# EAGLE design bGeigieNanoKit V1.1r4a (EAGLE 7.7.0)
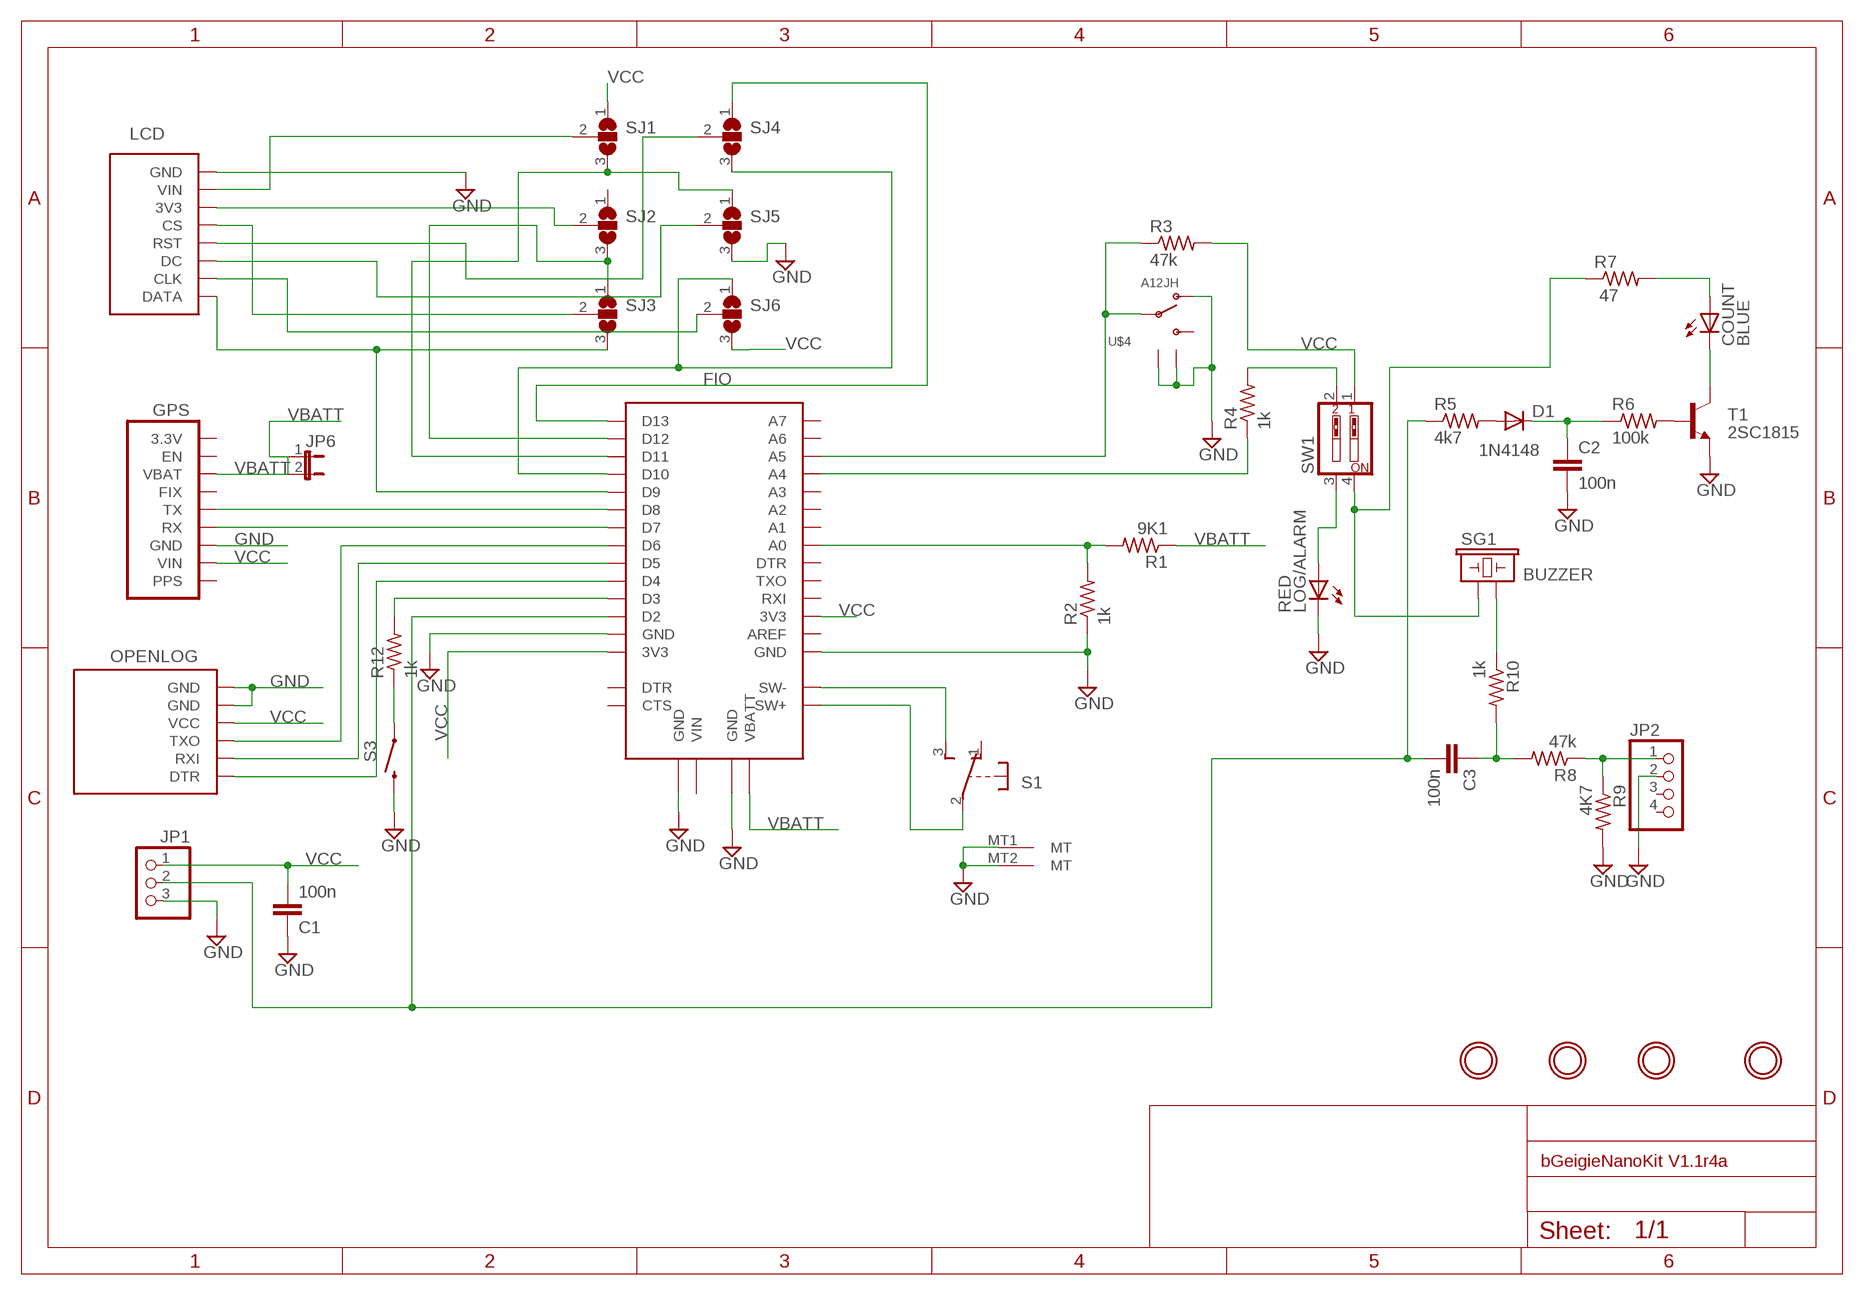
[diagram p0: schematic, sheet 1]

## Parts
C1  100n  C-EU025-024X044  [C025-024X044]
C2  100n  C-EU025-024X044  [C025-024X044]
C3  100n  C-EU025-024X044  [C025-024X044]
COUNT  BLUE  LED3MM  [LED3MM]
D1  1N4148  1N4148DO35-7  [DO35-7]
FIO  FIO_SOCKETBOT  [FIO_V23_SOCKET_BOT]
GPS  ULTIMATE_GPSTOP  [ULTIMATE_GPS_V3_TOP]
JP1  PINHD-1X3/90  [1X03/90]
JP2  HEADER-1X4ROUND  [1X04_ROUND]
JP6  JUMPER-2SMD-NC  [SJ_2S]
LCD  SSD1306_128X64_V2_LCD1.3IN_LEVER  [SSD1306_128X64_1.3IN_LCD_LEVER]
LOG/ALARM  RED  LED3MM  [LED3MM]
OPENLOG  OPENLOG  [OPENLOG]
R1  9K1  R-US_0207/10  [0207/10]
R2  1k  R-US_0207/10  [0207/10]
R3  47k  R-US_0207/10  [0207/10]
R4  1k  R-US_0207/10  [0207/10]
R5  4k7  R-US_0207/10  [0207/10]
R6  100k  R-US_0207/10  [0207/10]
R7  47  R-US_0207/10  [0207/10]
R8  47k  R-US_0207/10  [0207/10]
R9  4K7  R-US_0207/10  [0207/10]
R10  1k  R-US_0207/10  [0207/10]
R12  1k  R-US_0207/10  [0207/10]
S1  S1  EG1206  [EG1206]
S3  SWITCH-MOMENTARY-2PTH  [TACTILE-PTH]
SG1  BUZZER  BUZZERPTH  [BUZZER-12MM]
SJ1  SJ2W  [SJ_2]
SJ2  SJ2W  [SJ_2]
SJ3  SJ2W  [SJ_2]
SJ4  SJ2W  [SJ_2]
SJ5  SJ2W  [SJ_2]
SJ6  SJ2W  [SJ_2]
SW1  SW_DIP-2  [EDG-02]
T1  2SC1815  [TO92-ECB]
U$4  A12JH  [A12AH]
U$6  MOUNTINGHOLE3.0THIN  [MOUNTINGHOLE_3.0_PLATEDTHIN]
U$7  MOUNTINGHOLE3.0THIN  [MOUNTINGHOLE_3.0_PLATEDTHIN]
U$8  MOUNTINGHOLE3.0THIN  [MOUNTINGHOLE_3.0_PLATEDTHIN]
U$9  MOUNTINGHOLE3.0THIN  [MOUNTINGHOLE_3.0_PLATEDTHIN]

## Nets
GND [PWP]: C1.1 C2.2 FIO.JP1$2(GND) FIO.JP2$1(GND) FIO.JP5$1(GND) FIO.JP6$1(GND) GPS.JP1$3(GND) GPS.U$8$P$1(GND) GPS.U$9$P$1(GND) JP1.3 JP2.2 LCD.JP1$8(GND) LCD.U$23$P$1(GND) LCD.U$26$P$1(GND) LOG/ALARM.K(C) OPENLOG.JP1$5(GND) OPENLOG.JP1$6(GND) R2.1 R9.2 S1.MT1(MT) S1.MT2(MT) S3.3 SJ5.3 T1.E U$4.P$1 U$4.P$4(GND) U$4.P$5(GND)
N$1: FIO.JP1$10(D9) LCD.JP1$1(DATA) SJ3.3
N$2: FIO.JP1$11(D10) SJ4.3 SJ6.1
N$3: FIO.JP1$12(D11) SJ1.3 SJ5.1
N$4: FIO.JP1$13(D12) SJ2.3 SJ3.1
N$5: FIO.JP1$14(D13) SJ4.1
N$6: FIO.JP1$9(D8) GPS.JP1$5(TX)
N$7: FIO.JP1$8(D7) GPS.JP1$4(RX)
N$8: FIO.JP1$7(D6) OPENLOG.JP1$3(TXO)
N$9: FIO.JP1$6(D5) OPENLOG.JP1$2(RXI)
N$10: FIO.JP1$5(D4) OPENLOG.JP1$1(DTR)
N$11: FIO.JP5$7(A0) R1.2 R2.2
N$12 [HIGH_PWR]: FIO.JP7$2(SW+) S1.2(1:P)
N$13 [HIGH_PWR]: FIO.JP7$1(SW-) S1.3(1:S)
N$14: FIO.JP5$12(A5) R3.1 U$4.P$2
N$16: LOG/ALARM.A SW1.3
N$17: R4.2 SW1.2
N$18: C3.2 FIO.JP1$3(D2) JP1.2 R5.1
N$19: COUNT.A R7.2
N$20: R12.1 S3.1
N$22: COUNT.K(C) T1.C
N$23: R10.1 SG1.-
N$24: C3.1 R8.2 R10.2
N$25: JP2.1 R8.1 R9.1
N$26: D1.A R5.2
N$27: C2.1 D1.C R6.1
N$28: R6.2 T1.B
N$30: FIO.JP1$4(D3) R12.2
N$31: LCD.JP1$7(VIN) SJ1.2
N$32: R7.1 SG1.+ SW1.4
N$33: FIO.JP5$11(A4) R4.1
N$34: LCD.JP1$6(3V3) SJ2.2
N$35: LCD.JP1$5(CS) SJ3.2
N$36: LCD.JP1$4(RST) SJ4.2
N$37: LCD.JP1$3(DC) SJ5.2
N$38: LCD.JP1$2(CLK) SJ6.2
VBATT: FIO.JP2$2(VBATT) GPS.JP1$7(VBAT) JP6.1 JP6.2 R1.1
VCC [PWP]: C1.2 FIO.JP1$1(3V3) FIO.JP5$3(3V3) GPS.JP1$2(VIN) JP1.1 OPENLOG.JP1$4(VCC) R3.2 SJ1.1 SJ6.3 SW1.1
Unconnected: FIO.JP5$2(AREF) FIO.JP5$4(RXI) FIO.JP5$5(TXO) FIO.JP5$6(DTR) FIO.JP5$8(A1) FIO.JP5$9(A2) FIO.JP5$10(A3) FIO.JP5$13(A6) FIO.JP5$14(A7) FIO.JP6$2(VIN) FIO.JP8$1(CTS) FIO.JP9$1(DTR) GPS.JP1$1(PPS) GPS.JP1$6(FIX) GPS.JP1$8(EN) GPS.JP1$9(3.3V) JP2.3 JP2.4 S1.1(1:O) SJ2.1 U$4.P$3

## Library data of the parts
C1-C3 = rcl:C-EU: CAPACITOR, European symbol
COUNT LOG/ALARM = adafruit:LED: LED OSRAM: - CHIPLED LG R971, LG N971, LY N971, LG Q971, LY Q971, LO R971, LY R971 LH N974, LH R974 LS Q976, LO Q976, LY Q976 LO Q996 - Hyper CHIPLED LW Q18S LB Q993, LB Q99A, LB R99A - SideLED LS A670, LO A670, LY A670, LG A670, LP A670 LB A673, LV A673, LT A673, LW A673 LH A674 LY A675 LS A676, LA A676, LO A676, LY A676, LW A676 LS A679, LY A679, LG A679 - Hyper Micro SIDELED® LS Y876, LA Y876, LO Y876, LY Y876 LT Y87S - SmartLED LW L88C, LW L88S LB L89C, LB L89S, LG L890 LS L89K, LO L89K, LY L89K LS L896, LA L896, LO L896, LY L896 - TOPLED LS T670, LO T670, LY T670, LG T670, LP T670 LSG T670, LSP T670, LSY T670, LOP T670, LYG T670 LG T671, LOG T671, LSG T671 LB T673, LV T673, LT T673, LW T673 LH T674 LS T676, LA T676, LO T676, LY T676, LB T676, LH T676, LSB T676, LW T676 LB T67C, LV T67C, LT T67C, LS T67K, LO T67K, LY T67K, LW E67C LS E67B, LA E67B, LO E67B, LY E67B, LB E67C, LV E67C, LT E67C LW T67C LS T679, LY T679, LG T679 LS T770, LO T770, LY T770, LG T770, LP T770 LB T773, LV T773, LT T773, LW T773 LH T774 LS E675, LA E675, LY E675, LS T675 LS T776, LA T776, LO T776, LY T776, LB T776 LHGB T686 LT T68C, LB T68C - Hyper Mini TOPLED® LB M676 - Mini TOPLED Santana® LG M470 LS M47K, LO M47K, LY M47K Source: http://www.osram.convergy.de/
D1 = diode:1N4148: DIODE high speed (Philips); D1: 1N4148
FIO = open_hw_sockets:FIO_SOCKET
GPS = open_hw_sockets:ULTIMATE_GPS
JP1 = pinhead:PINHD-1X3: PIN HEADER
JP2 = microbuilder:HEADER-1X4: PIN HEADER
JP6 = SparkFun:JUMPER-2: Jumper Basic 0.1" spaced jumper. Use with breakaway headers.
LCD = open_hw_sockets:SSD1306_128X64_V2_LCD
OPENLOG = open_hw_sockets:OPENLOG
R1-R10 R12 = rcl:R-US_: RESISTOR, American symbol
S1 = open_hw_sockets:EG1206: E-Switch right-angle slide SPDT Part #EG1213 http://www.ladyada.net/library/eagle
S3 = SparkFun:SWITCH-MOMENTARY-2
SG1 = SparkFun-Electromechanical:BUZZER: Buzzer 12mm Spark Fun Electronics SKU : Comp-Buzzer
SJ1-SJ6 = jumper:SJ2W: SMD solder JUMPER
SW1 = special:SW_DIP-2: DIP SWITCH
T1 = transistor:2SC1815: NPN EPITAXIAL TRANSISTOR Source: TOSHIBA .. 2SC1815 1.pdf
U$4 = open_hw_sockets:A12JH
U$6-U$9 = microbuilder:MOUNTINGHOLE: Mounting Hole For #2 screws (0.086"/2.18mm width, 0.094"/2.4mm hole) use 2.5mm

## Net classes
0 default: width 0.406 mm, drill 0.254 mm, clearance 0.305 mm
1 PWP: width 0.813 mm, drill 0.254 mm, clearance 0.305 mm
2 HIGH_PWR: width 1.422 mm, drill 0.508 mm, clearance 0.406 mm

## Board
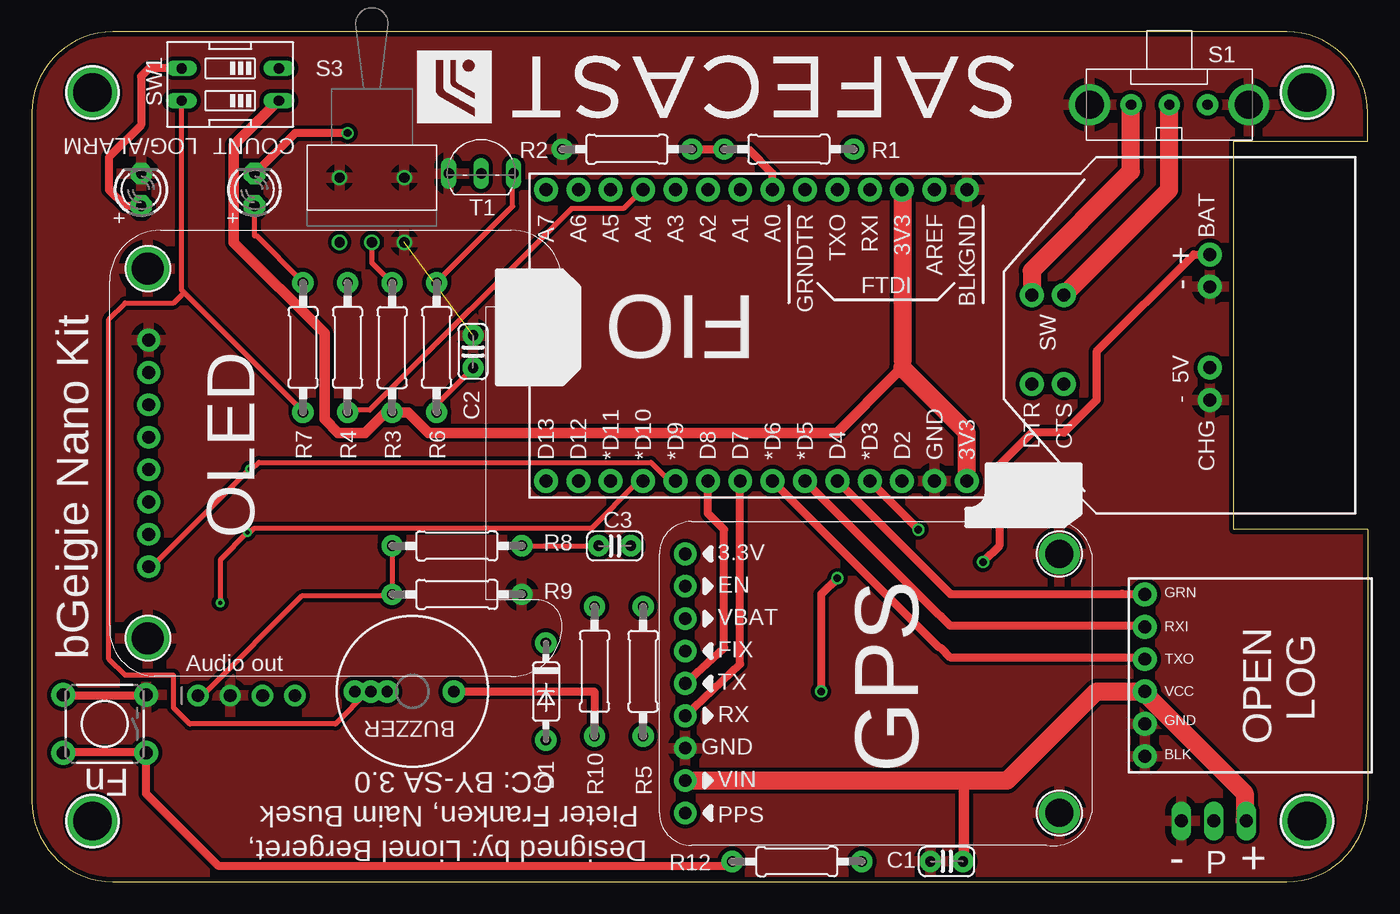
[diagram p1: board, top side]
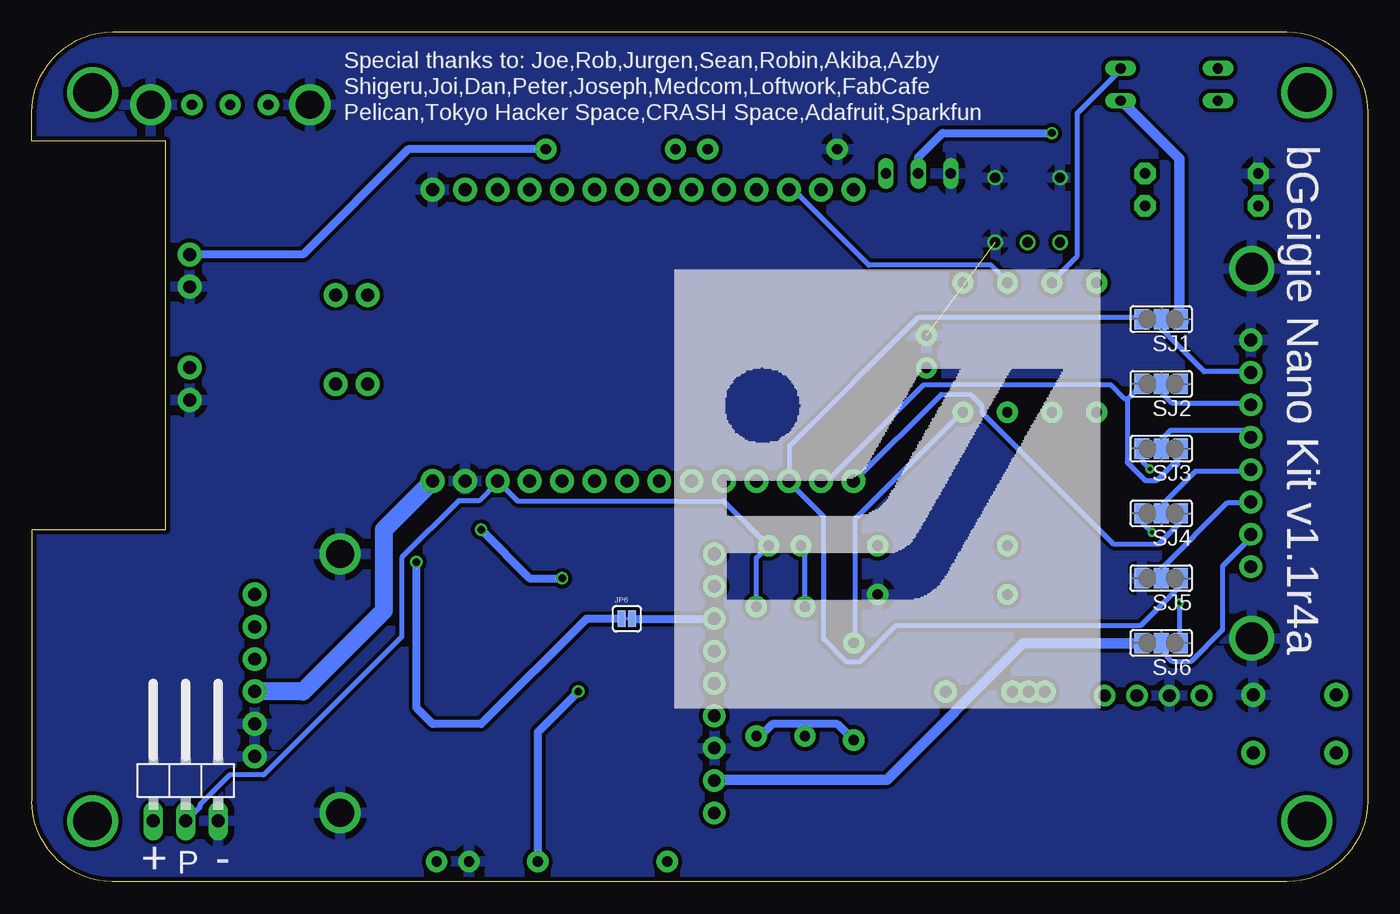
[diagram p2: board, bottom side, seen from below]

Size 104.77 x 66.67 mm. Coordinates in mm from the lower left corner, seen from the top.
Outline: 0,60.33 0,6.35 arc90 6.35,0 98.43,0 arc90 104.77,6.35 104.77,27.62 94.3,27.62 94.3,58.1 104.77,58.1 104.77,60.33 arc90 98.43,66.68 6.35,66.68 arc90 0,60.33
Copper layers (1*16): Top 0.0356mm / dielectric 1.5011mm / Bottom 0.0356mm
Design rules "LaenPCBOrder *": minimum track width 6mil, minimum drill 13mil, track to track 6mil, track to pad 6mil, pad to pad 6mil, via to via 6mil, smd to smd 6mil, copper to edge 15mil, drill to drill 6mil, minimum pad ring 7mil, minimum via ring 7mil, stop-mask expansion 4mil, vias tented up to drill 0mil, thermal gap 20mil

### Footprints (pad centres in the part's own frame; a part is rotated, then mirrored left to right if it is on the bottom)
C025-024X044 = drill 0.813 pad 1.676: 1 -1.27,0; 2 1.27,0
LED3MM = drill 0.813 pad 1.676 octagon: A -1.27,0; K 1.27,0
DO35-7 = drill 0.813 pad 1.676: A 3.81,0; C -3.81,0
FIO_V23_SOCKET_BOT = drill 1.016 pad 1.88: JP1$1 1.27,34.29; JP1$2 1.27,31.75; JP1$3 1.27,29.21; JP1$4 1.27,26.67; JP1$5 1.27,24.13; JP1$6 1.27,21.59; JP1$7 1.27,19.05; JP1$8 1.27,16.51; JP1$9 1.27,13.97; JP1$10 1.27,11.43; JP1$11 1.27,8.89; JP1$12 1.27,6.35; JP1$13 1.27,3.81; JP1$14 1.27,1.27; JP2$1 16.51,53.34; JP2$2 19.05,53.34; JP5$1 24.13,34.29; JP5$2 24.13,31.75; JP5$3 24.13,29.21; JP5$4 24.13,26.67; JP5$5 24.13,24.13; JP5$6 24.13,21.59; JP5$7 24.13,19.05; JP5$8 24.13,16.51; JP5$9 24.13,13.97; JP5$10 24.13,11.43; JP5$11 24.13,8.89; JP5$12 24.13,6.35; JP5$13 24.13,3.81; JP5$14 24.13,1.27; JP6$1 7.62,53.34; JP6$2 10.16,53.34; JP7$1 15.875,39.37; JP7$2 15.875,41.91; JP8$1 8.89,41.91; JP9$1 8.89,39.37
ULTIMATE_GPS_V3_TOP = drill 1 pad 1.778: JP1$1 22.86,2.032; JP1$2 20.32,2.032; JP1$3 17.78,2.032; JP1$4 15.24,2.032; JP1$5 12.7,2.032; JP1$6 10.16,2.032; JP1$7 7.62,2.032; JP1$8 5.08,2.032; JP1$9 2.54,2.032 | drill 2.2 pad 3: U$8$P$1 2.54,31.385; U$9$P$1 22.86,31.385
1X03/90 = drill 1.016 long: 1 -2.54,-3.81; 2 0,-3.81; 3 2.54,-3.81
1X04_ROUND = drill 1 pad 1.676: 1 -3.81,0; 2 -1.27,0; 3 1.27,0; 4 3.81,0
SJ_2S = smd 0.635 x 1.27: 1 -0.412,0; 2 0.412,0
SSD1306_128X64_1.3IN_LCD_LEVER = drill 1 pad 1.778: JP1$1 8.61,32.43; JP1$2 11.15,32.43; JP1$3 13.69,32.43; JP1$4 16.23,32.43; JP1$5 18.77,32.43; JP1$6 21.31,32.43; JP1$7 23.85,32.43; JP1$8 26.39,32.43 | drill 2.5 pad 3.2: U$23$P$1 32,32.5; U$26$P$1 3,32.5
OPENLOG = drill 1.016 pad 1.88: JP1$1 1.27,1.27; JP1$2 3.81,1.27; JP1$3 6.35,1.27; JP1$4 8.89,1.27; JP1$5 11.43,1.27; JP1$6 13.97,1.27
0207/10 = drill 0.813 pad 1.676: 1 -5.08,0; 2 5.08,0
EG1206 = drill 0.8 pad 1.676: 1 -3,0; 2 0,0; 3 3,0 | drill 2.2 pad 3: MT1 -6.25,0; MT2 6.25,0
TACTILE-PTH = drill 1.016 pad 1.88: 1 -3.251,2.261; 2 3.251,2.261; 3 -3.251,-2.261; 4 3.251,-2.261
BUZZER-12MM = drill 0.9 pad 1.778: + 3.25,0; +1 4.52,0; +2 3.25,0; +3 1.98,0; - -3.25,0
SJ_2 = smd 1.168 x 1.6: 1 -1.524,0; 2 0,0; 3 1.524,0
EDG-02 = drill 0.813 long: 1 -1.27,-3.81; 2 1.27,-3.81; 3 1.27,3.81; 4 -1.27,3.81
TO92-ECB = drill 0.813 long: B 2.54,0; C 0,0; E -2.54,0
A12AH = drill 0.8: P$1 -2.54,5.08; P$2 0,5.08; P$3 2.54,5.08; P$4 -2.54,0; P$5 2.54,0
MOUNTINGHOLE_3.0_PLATEDTHIN = drill 3 pad 3.6: P$1 0,0

### Placement (x,y rotation side)
C1  71.75,1.59 0 top
C2  34.61,41.59 90 top
C3  45.72,26.35 0 top
COUNT  17.46,54.29 90 top
D1  40.32,14.92 270 top
FIO  39.05,30.16 90 bottom
GPS  49.21,28.26 270 top
JP1  92.71,8.57 0 bottom
JP2  16.83,14.6 0 top
JP6  58.1,20.64 0 bottom
LCD  41.59,16.1 90 top
LOG/ALARM  8.57,54.29 90 top
OPENLOG  86.04,23.81 270 top
R1  59.37,57.47 180 top
R2  46.67,57.47 0 top
R3  28.26,41.91 270 top
R4  24.77,41.91 90 top
R5  47.94,16.51 270 top
R6  31.75,41.91 90 top
R7  21.27,41.91 90 top
R8  33.34,26.35 0 top
R9  33.34,22.54 0 top
R10  44.13,16.51 90 top
R12  60.01,1.59 0 top
S1  89.22,60.96 180 top
S3  5.71,12.38 180 top
SG1  29.85,14.92 180 top
SJ1  16.19,44.13 180 bottom
SJ2  16.19,39.05 180 bottom
SJ3  16.19,33.97 180 bottom
SJ4  16.19,28.89 180 bottom
SJ5  16.19,23.81 180 bottom
SJ6  16.19,18.73 180 bottom
SW1  15.56,62.55 90 top
T1  35.24,55.56 0 top
U$1  [SAFECAST_LOGO4]  54.29,47.94 270 bottom
U$4  26.67,55.25 180 top
U$5  [SAFECAST_LOGO2]  77.6,65.72 180 top
U$6  100.01,61.91 0 top
U$7  100.01,4.76 0 top
U$8  4.76,4.76 0 top
U$9  4.76,61.91 0 top

### Tracks (layer width: path | path; a pad name or v marks a point on that pad's centre or on a via)
GND  (1 unrouted)
  pour Bottom (isolate 0.305): -1.59,-1.59 106.36,-1.59 106.36,68.26 -1.59,68.26
  pour Top (isolate 0.305): -1.59,-1.59 106.36,-1.59 106.36,68.26 -1.59,68.26
N$1  (via drill 0.33)
  Top 0.406: 9.26,24.73 LCD.JP1$1 9.44,24.73 v17.08,32.37 17.26,32.37 17.79,32.91 48.55,32.91 49.97,31.48 50.33,31.48 FIO.JP1$10
  Bottom 0.406: v17.08,32.37 17.61,32.91 17.61,33.97 SJ3.3
N$2  (via drill 0.33)
  Top 0.406: v14.77,21.88 14.77,25.26 v16.9,27.39 17.08,27.39 17.44,27.75 43.93,27.75 47.49,31.31 47.84,31.31 FIO.JP1$11
  Bottom 0.406: 17.79,28.99 SJ4.3 17.61,28.82 17.61,28.11 v16.9,27.39 | v14.77,21.88 14.77,18.86 SJ6.1
N$3
  Bottom 0.406: SJ5.1 14.77,23.66 14.77,23.13 17.79,20.1 37,20.1 39.84,17.26 40.91,17.26 42.68,19.04 42.68,28.64 45.35,31.31 FIO.JP1$12 45.35,31.48 45.35,34.15 35.22,44.28 17.79,44.28 SJ1.3
N$4
  Bottom 0.406: 18.86,37.88 18.86,32.91 17.44,31.48 16.55,31.48 14.77,33.26 14.77,33.97 SJ3.1 | 18.86,37.88 17.79,38.95 SJ2.3 | FIO.JP1$13 42.86,31.48 42.33,31.48 34.86,38.95 20.1,38.95 19.04,37.88 18.86,37.88
N$5
  Bottom 0.406: SJ4.1 14.77,28.82 14.77,28.11 16.37,26.5 19.93,26.5 30.24,36.82 30.24,37.35 31.13,38.24 33.44,38.24 40.2,31.48 FIO.JP1$14
N$6
  Top 0.61: GPS.JP1$5 54.29,18.35 54.29,27.62 53.02,28.89 FIO.JP1$9
N$7
  Top 0.61: GPS.JP1$4 55.56,17.08 FIO.JP1$8
N$8
  Top 0.406: 87.31,17.61 OPENLOG.JP1$3 | 71.31,18.33 71.12,18.42
  Top 0.61: FIO.JP1$7 71.12,18.42 | 87.31,17.61 72.02,17.61 71.31,18.33
N$9
  Top 0.406: 87.31,20.1 OPENLOG.JP1$2 | 71.31,20.82 71.12,20.96
  Top 0.61: FIO.JP1$6 71.12,20.96 | 87.31,20.1 72.02,20.1 71.31,20.82
N$10
  Top 0.406: 87.31,22.59 OPENLOG.JP1$1 | 85.53,22.59 85.41,22.54
  Top 0.61: FIO.JP1$5 72.07,22.54 85.41,22.54 | 85.53,22.59 87.31,22.59
N$11
  Top 0.61: FIO.JP5$7 58.1,55.56 56.2,57.47 R1.2 R2.2
N$12
  Top 1.422: FIO.JP7$2 89.22,54.29 S1.2
N$13
  Top 1.422: FIO.JP7$1 78.42,47.94 86.22,55.74 S1.3
N$14
  Top 0.406: U$4.P$2 26.68,48.55 28.11,47.13 R3.1
  Bottom 0.406: FIO.JP5$12 45.35,54.24 45,54.24 39.13,48.37 29.53,48.37 28.28,47.13 R3.1
N$15
  Bottom 0.61: 25.08,14.92 27.62,14.92
N$16
  Top 0.61: SW1.3 9.21,63.82 8.57,63.18 8.57,59.37 6.03,56.83 6.03,54.29 7.3,53.02 LOG/ALARM.A
N$17
  Bottom 0.406: SW1.2 19.39,63.67 22.77,60.29 22.77,49.09 24.73,47.13 R4.2
N$18
  Bottom 0.406: JP1.2 92.65,4.81 91.58,5.88 91.58,6.06 89.27,8.37 86.6,8.37 75.76,19.22 75.76,25.44 71.31,29.88 69.71,29.88 68.29,31.31 FIO.JP1$3 68.11,31.31 66.69,29.88 50.52,29.88 C3.2 47.94,25.4 R5.1
N$19
  Top 0.406: 17.61,53 COUNT.A 17.46,50.69 17.61,50.69 21.17,47.13 R7.2
N$20
  Top 0.61: R12.1 54.61,1.27 14.6,1.27 8.97,6.91 S3.1
N$21
  Top 0.61: 2.54,14.6 8.89,14.6
N$22  (via drill 0.6)
  Top 0.61: COUNT.K 20.64,58.74 v24.76,58.74
  Bottom 0.61: T1.C 35.24,56.83 33.34,58.74 v24.76,58.74
N$23
  Top 0.61: SG1.- 44.13,14.92 R10.1
N$24
  Top 0.406: R8.2 C3.1
  Bottom 0.406: R10.2 44.13,26.03 C3.1
N$25
  Top 0.406: 13.7,14.77 13.17,14.77 JP2.1 13.7,14.95 21.17,22.42 28.11,22.42 R9.1 28.28,22.59 28.28,26.33 R8.1
N$26
  Bottom 0.61: R5.2 47.94,11.11 46.67,12.38 41.59,12.38 D1.A
N$27
  Top 0.406: R6.1 31.84,37 31.84,37.53 34.51,40.2 C2.1
  Bottom 0.406: D1.C 40.2,18.86 40.2,28.46 31.84,36.82 R6.1
N$28
  Top 0.406: T1.B 37.71,55.49 37.71,53 31.84,47.13 R6.2
N$29
  Top 0.61: 8.89,10.16 2.54,10.16
N$30  (via drill 0.6)
  Top 0.61: FIO.JP1$4 v69.53,27.62 | v63.18,23.81 61.91,22.54 v61.91,14.92
  Bottom 0.61: v69.53,27.62 65.72,23.81 v63.18,23.81 | R12.2 65.09,11.75 v61.91,14.92
N$31
  Bottom 0.406: LCD.JP1$7 9.26,40.02 12.81,40.02 16.19,43.4 SJ1.2 14.92,44.13
N$32
  Top 0.406: SW1.4 11.75,46.42 11.94,46.23 | 11.94,46.23 21.17,37 R7.1 | SG1.+ 26.35,14.92 23.81,12.38 12.38,12.38 11.11,13.65 11.11,16.19 7.3,16.19 6.03,17.46 6.03,44.13 7.3,45.4 11.11,45.4 11.94,46.23
N$33
  Top 0.406: R4.1 24.9,37 26.5,37 42.33,52.82 46.42,52.82 47.84,54.24 FIO.JP5$11
N$34
  Bottom 0.406: LCD.JP1$6 9.26,37.53 15.3,37.53 16.19,38.42 SJ2.2 14.92,39.05
N$35
  Bottom 0.406: LCD.JP1$5 9.26,35.04 9.61,35.39 15.48,35.39 16.19,34.68 SJ3.2 14.92,33.97 14.92,32.7
N$36
  Bottom 0.406: LCD.JP1$4 9.26,32.19 13.53,32.19 16.19,29.53 SJ4.2 14.92,28.89
N$37
  Bottom 0.406: LCD.JP1$3 9.26,29.71 11.04,29.71 16.19,24.55 SJ5.2 14.92,23.81
N$38
  Bottom 0.406: 9.08,27.22 LCD.JP1$2 9.08,27.04 11.39,24.73 11.39,19.75 13.88,17.26 15.3,17.26 16.19,18.15 SJ6.2 14.92,18.73
VBATT  (via drill 0.6)
  Top 0.61: v74.61,25.08 75.88,26.35 75.88,32.7 78.42,35.24 80.96,35.24 83.5,37.78 83.5,41.59 91.12,49.21 FIO.JP2$2
  Bottom 0.254: JP6.2 JP6.1
  Bottom 0.61: JP6.1 61.28,20.64 69.53,12.38 73.34,12.38 74.61,13.65 v74.61,25.08 | R1.1 75.25,57.47 83.5,49.21 FIO.JP2$2 | JP6.2 GPS.JP1$7
VCC
  Top 0.813: 68.29,40.91 68.26,40.32 67.75,39.84 63.13,35.22 31.13,35.22 29.53,36.82 28.64,36.82 R3.2 28.11,36.82 27.75,36.82 26.15,35.22 24.02,35.22 22.95,36.28 22.95,43.04 15.84,50.15 15.84,57.8 19.22,61.18 SW1.1 | 68.29,53.71 FIO.JP5$3 | 73.09,7.94 73.09,1.61 C1.2 | 95.14,4.81 JP1.1 | 87.67,14.41 OPENLOG.JP1$4
  Top 1.422: FIO.JP1$1 73.34,35.24 68.26,40.32 | 68.29,53.71 68.29,40.91 | GPS.JP1$2 73.09,7.94 76.52,7.94 83.5,14.92 OPENLOG.JP1$4 | 95.14,4.81 95.14,6.95 87.67,14.41
  Bottom 0.813: 14.41,43.93 SJ1.1 14.77,44.46 14.77,56.73 19.22,61.18 SW1.1 | SJ6.3 17.79,18.68 27.04,18.68 37.71,8.01 51.4,8.01 GPS.JP1$2
  Bottom 1.422: FIO.JP1$1 77.15,27.62 77.15,21.27 83.5,14.92 OPENLOG.JP1$4

### Text on the board
tPlace: S3 | FIO | OLED | bGeigie Nano Kit | Audio out | OPEN / LOG | Fn | GPS | + | Designed by: Lionel Bergeret, / Pieter Franken, Naim Busek / CC: BY-SA 3.0 | - | P
bPlace: Special thanks to: Joe,Rob,Jurgen,Sean,Robin,Akiba,Azby / Shigeru,Joi,Dan,Peter,Joseph,Medcom,Loftwork,FabCafe / Pelican,Tokyo Hacker Space,CRASH Space,Adafruit,Sparkfun | bGeigie Nano Kit v1.1r4a | - | P | +